# Altium schematic sheet conn_lv.SchDoc
size A; SheetNumber: 4
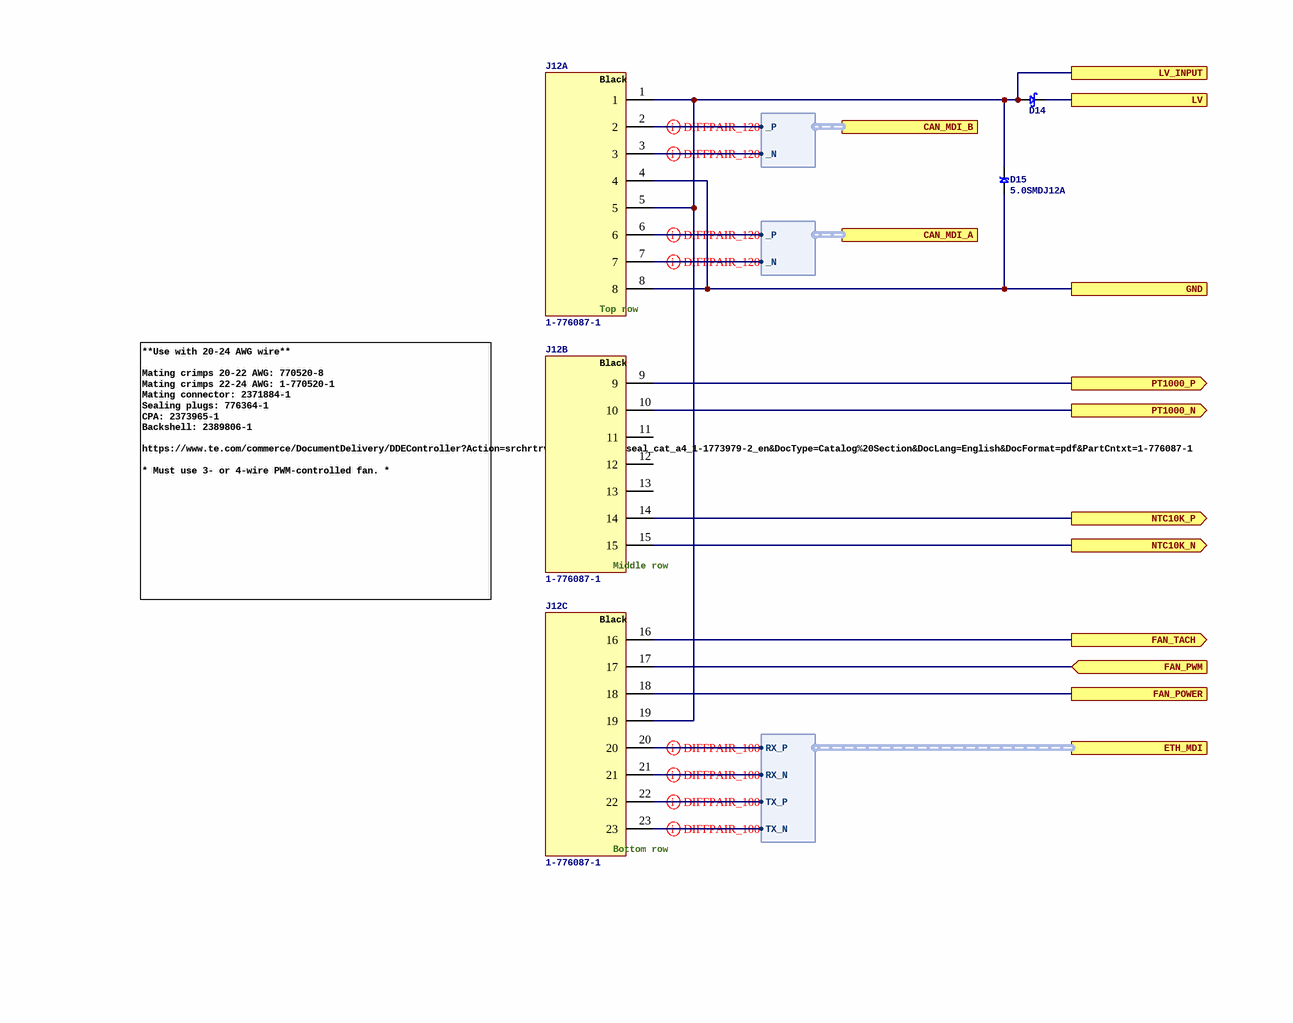
[diagram p0: conn_lv.SchDoc]

## Parts
D14  B340A-13-F  [SMA]  (value not drawn)
D15  5.0SMDJ12A  [SMC]
J12  1-776087-1  [TE_AMPSEAL_1-776087-1]  (parts A,B,C of 3)

## Ports
CAN_MDI_A (harness DIFF), CAN_MDI_B (harness DIFF), ETH_MDI (harness 100BASE-TX), FAN_POWER, FAN_PWM (in), FAN_TACH (out), GND, LV, LV_INPUT, NTC10K_N (out), NTC10K_P (out), PT1000_N (out), PT1000_P (out)

## Harnesses
DIFF: _P, _N
100BASE-TX: TX_N, TX_P, RX_N, RX_P

## Nets
FAN_POWER: J12.18 ; port FAN_POWER
FAN_PWM: J12.17 ; port FAN_PWM
FAN_TACH: J12.16 ; port FAN_TACH
GND: D15.1 J12.4 J12.8 ; port GND
LV: D14.2 ; port LV
LV_INPUT: D14.1 D15.2 J12.1 J12.5 J12.19 ; port LV_INPUT
NTC10K_N: J12.15 ; port NTC10K_N
NTC10K_P: J12.14 ; port NTC10K_P
PT1000_N: J12.10 ; port PT1000_N
PT1000_P: J12.9 ; port PT1000_P
NetJ12_2: J12.2 ; port CAN_MDI_B._P
NetJ12_3: J12.3 ; port CAN_MDI_B._N
NetJ12_6: J12.6 ; port CAN_MDI_A._P
NetJ12_7: J12.7 ; port CAN_MDI_A._N
NetJ12_20: J12.20 ; port ETH_MDI.RX_P
NetJ12_21: J12.21 ; port ETH_MDI.RX_N
NetJ12_22: J12.22 ; port ETH_MDI.TX_P
NetJ12_23: J12.23 ; port ETH_MDI.TX_N

Not connected (* = marked no-connect by the designer): J12 11 12 13

## Layout directives
differential pair; differential pair class DE_100: NetJ12_2, NetJ12_3, NetJ12_6, NetJ12_7, NetJ12_20, NetJ12_21, NetJ12_22, NetJ12_23

## Notes on the sheet
- **Use with 20-24 AWG wire**
  Mating crimps 20-22 AWG: 770520-8
  Mating crimps 22-24 AWG: 1-770520-1
  Mating connector: 2371884-1
  Sealing plugs: 776364-1
  CPA: 2373965-1
  Backshell: 2389806-1
  https://www.te.com/commerce/DocumentDelivery/DDEController?Action=srchrtrv&DocNm=ict_ampseal_cat_a4_1-1773979-2_en&DocType=Catalog%20Section&DocLang=English&DocFormat=pdf&PartCntxt=1-776087-1
  * Must use 3- or 4-wire PWM-controlled fan. *
- (in symbol CONN_AMPSEAL_23POS_RA_1-776087-1, part A) Black; Top row
- (in symbol CONN_AMPSEAL_23POS_RA_1-776087-1, part B) Black; Middle row
- (in symbol CONN_AMPSEAL_23POS_RA_1-776087-1, part C) Black; Bottom row

## Library data of the parts
D14 = SCHOTTKY_B340A-13-F: Rectifier Diode, Schottky, 1 Phase, 1 Element, 3A, 40V V(RRM), Silicon; Manufacturer: Diodes; Supplier 1: Digikey; ComponentLink1URL: https://www.diodes.com/assets/Datasheets/ds30891.pdf; Supplier Part Number 1: B340A-FDICT-ND; ComponentLink1Description: Datasheet; Manufacturer Part Number: B340A-13-F; Supplier 2: LCSC; Supplier Part Number 2: C85098
D15 = TVS_UNI_5.0SMDJ12A: TVS 5000W 12V UNIDIRECT SMCJ; Manufacturer: Littelfuse; ComponentLink1URL: https://www.littelfuse.com/media?resourcetype=datasheets&itemid=2b2f4a8c-2e81-4894-8d41-3d748bb79e68&filename=littelfuse-tvs-diode-5-0smdj-datasheet; ComponentLink1Description: Datasheet; Supplier 1: Digikey; Supplier Part Number 1: 5.0SMDJ12ACT-ND; Manufacturer Part Number: 5.0SMDJ12A; Supplier 2: LCSC; Supplier Part Number 2: C126819
J12 = CONN_AMPSEAL_23POS_RA_1-776087-1: Conn Power PL 23 POS 4mm Solder RA Thru-Hole 23 Terminal 1 Port, BLACK; Manufacturer: TE Connectivity; Supplier 1: Digikey; Supplier Part Number 1: 1734-1-776087-1-ND; Manufacturer Part Number: 1-776087-1; ComponentLink1Description: Product page; ComponentLink1URL: https://www.te.com/en/product-1-776087-1.html; ComponentLink2Description: Drawing; ComponentLink2URL: https://www.te.com/commerce/DocumentDelivery/DDEController?Action=srchrtrv&DocNm=776087&DocType=Customer%20Drawing&DocLang=English&DocFormat=pdf&PartCntxt=1-776087-1; ComponentLink3Description: Application specification; ComponentLink3URL: https://www.te.com/commerce/DocumentDelivery/DDEController?Action=srchrtrv&DocNm=114-16016&DocType=Specification%20Or%20Standard&DocLang=English&DocFormat=pdf&PartCntxt=1-776087-1; Supplier 2: LCSC; Supplier Part Number 2: C590311; ComponentLink4Description: Series catalog; ComponentLink4URL: https://www.te.com/commerce/DocumentDelivery/DDEController?Action=srchrtrv&DocNm=1-1773979-2&DocType=Data%20Sheet&DocLang=English&DocFormat=pdf&PartCntxt=1-776087-1; ComponentLink5Description: Product specification; ComponentLink5URL: https://www.te.com/commerce/DocumentDelivery/DDEController?Action=srchrtrv&DocNm=108-1329&DocType=Specification%20Or%20Standard&DocLang=English&DocFormat=pdf&PartCntxt=1-776087-1